# EasyEDA schematic LCEDA_V5.1.json
TITLE: ESP32 Hub75 DevKit; REV: 5.1; Date: 2021-01-13; Sheet: 1/1; Drawn By: Kenn; Company: KZ
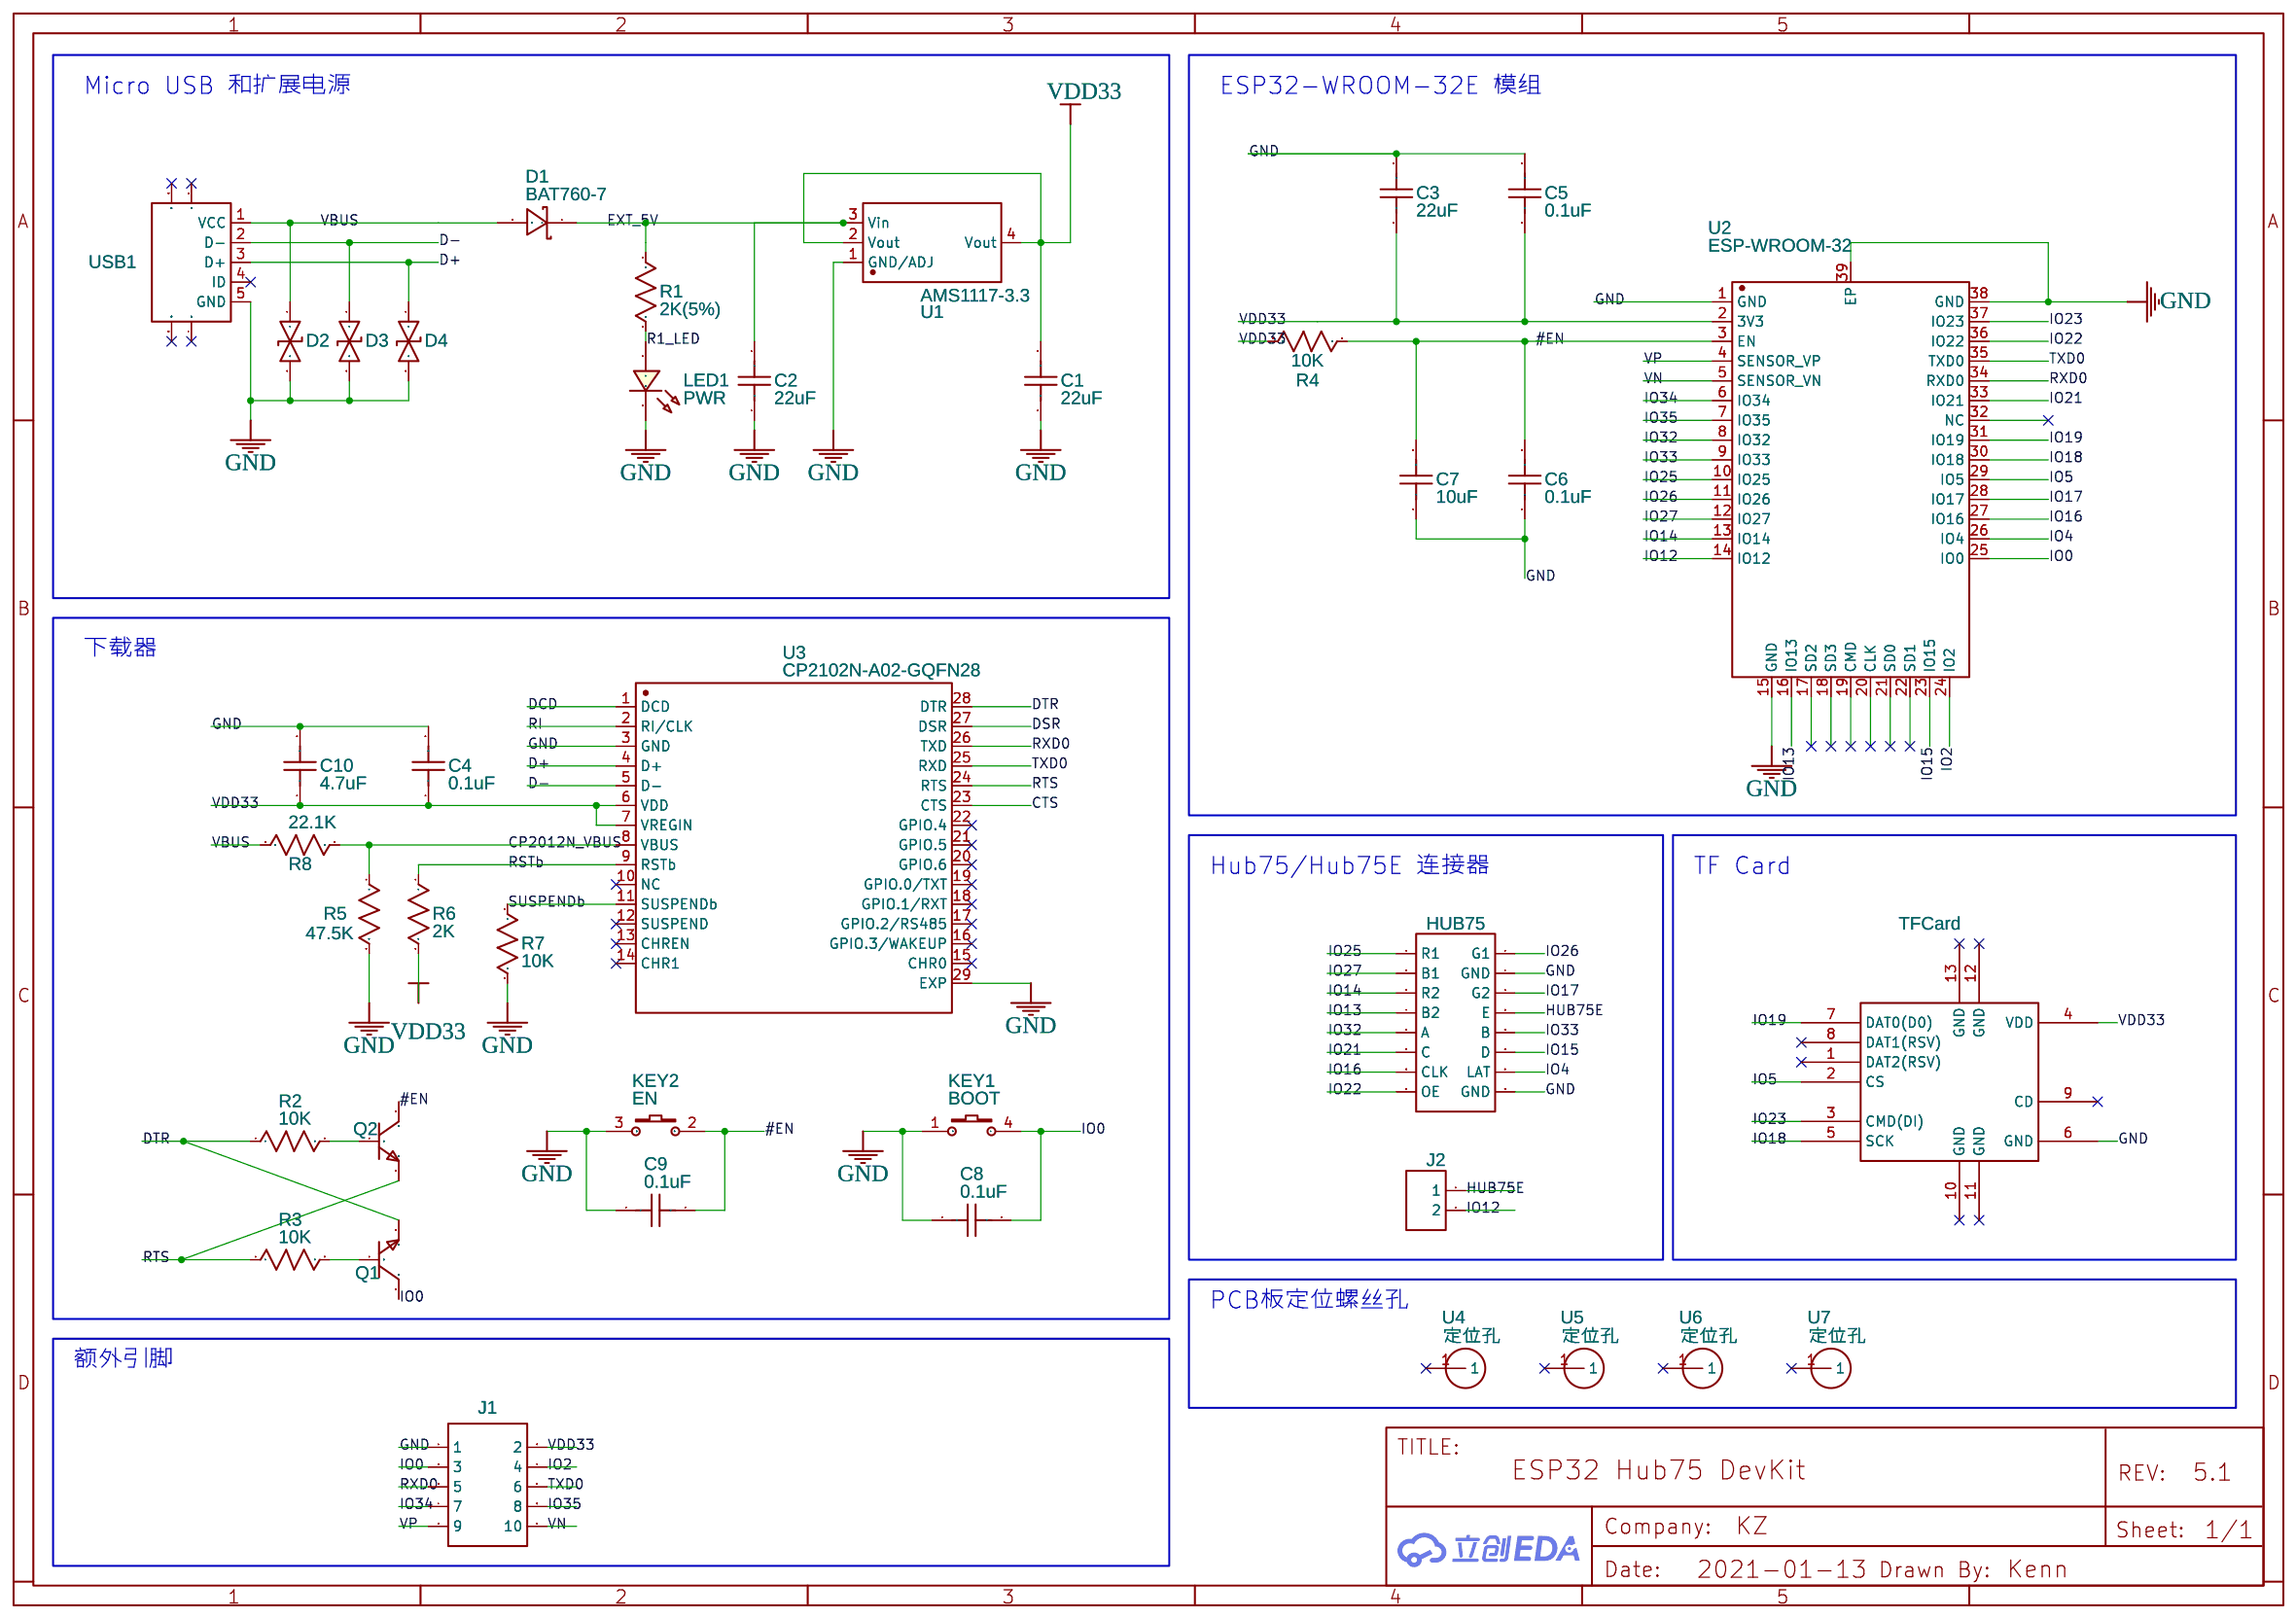
[diagram p0: schematic sheet]

## Parts
C1  22uF  [C0603]
C2  22uF  [C0603]
C3  22uF  [C0603]
C4  0.1uF  [C0603]
C5  0.1uF  [C0603]
C6  0.1uF  [C0603]
C7  10uF  [C0603]
C8  0.1uF  [C0603]
C9  0.1uF  [C0603]
C10  4.7uF  [C0603]
CARD1  TFCard  [TF-SMD_TF-015]
D1  BAT760-7  [SOD-323_L1.8-W1.3-LS2.5-RD]
D2  LESD5D5.0CT1G  [SOD-523_L1.2-W0.8-LS1.6-BI]
D3  LESD5D5.0CT1G  [SOD-523_L1.2-W0.8-LS1.6-BI]
D4  LESD5D5.0CT1G  [SOD-523_L1.2-W0.8-LS1.6-BI]
HUB75  HUB75-IDC-2.54-2X8P  [HDR-IDC-2.54-2X8P]
J1  HDR-M-2.54_2x5  [HDR-M-2.54_2X5]
J2  PIN-E  [HDR-M-2.54_1X2]
KEY1  BOOT  [SW-SMD_4P-L5.1-W5.1-P3.70-LS6.5-TL-2]
KEY2  EN  [SW-SMD_4P-L5.1-W5.1-P3.70-LS6.5-TL-2]
LED1  PWR  [LED0603_RED]
Q1  S8050-G_C164893  [SOT-23-3_L2.9-W1.3-P1.90-LS2.4-BR]
Q2  S8050-G_C164893  [SOT-23-3_L2.9-W1.3-P1.90-LS2.4-BR]
R1  2K(5%)  [R0603]
R2  10K  [R0603]
R3  10K  [R0603]
R4  10K  [R0603]
R5  47.5K  [R0603]
R6  2K  [R0603]
R7  10K  [R0603]
R8  22.1K  [R0603]
U1  AMS1117-3.3  [SOT-223-3_L6.5-W3.4-P2.30-LS7.0-BR]
U2  ESP-WROOM-32  [WIFI-SMD_ESP32-WROOM-32E]
U3  CP2102N-A02-GQFN28  [QFN-28_L5.0-W5.0-P0.50-BL-EP3.3]
U4  定位孔  [M3定位孔]
U5  定位孔  [M3定位孔]
U6  定位孔  [M3定位孔]
U7  定位孔  [M3定位孔]
USB1  USB-Micro_1  [MICRO-USB-SMD_MICROXNJ]

## Library data of the parts
C1-C3 = C_0603_US: Supplier Part: C59461; Supplier: LCSC; Contributor: LCEDA_Lib; Manufacturer Part: CL10A226MQ8NRNC; Manufacturer: SAMSUNG
C4-C6 C8 C9 = C_0603_US: Supplier Part: C14663; Supplier: LCSC; Contributor: LCEDA_Lib; Manufacturer Part: CC0603KRX7R9BB104; Manufacturer: YAGEO
C7 = C_0603_US: Supplier Part: C19702; Supplier: LCSC; Contributor: LCEDA_Lib; Manufacturer Part: CL10A106KP8NNNC; Manufacturer: SAMSUNG 三星
C10 = C_0603_US: Supplier Part: C19666; Supplier: LCSC; Contributor: LCEDA_Lib; Manufacturer Part: CL10A475KO8NNNC; Manufacturer: 三星
CARD1 = TF-015: Supplier: LCSC; Manufacturer: SOFNG; Manufacturer Part: TF-15x15; Supplier Part: C111196
D1 = BAT760-7: Supplier: LCSC; Manufacturer: DIODES; Contributor: LCSC; Supplier Part: C124187; SMT Type: Extend; JLCPCB SMD: Yes
D2-D4 = LESD5D5.0CT1G: Supplier: LCSC; Supplier Part: C383211; Manufacturer: Leshan Radio; Contributor: LCSC; SMT Type: Extend; JLCPCB SMD: Yes
HUB75 = -: Supplier: LCSC; Manufacturer: BOOMELE; Manufacturer Part: IDC Box 2.54mm 16P　Straight; image: //image.lceda.cn/szlcsc/C3406.jpg; Supplier Part: C3406
J1 = HDR-M-2.54_2x5: Supplier Part: C178292; Supplier: LCSC; Contributor: LCEDA_Lib
J2 = HDR-M-2.54_1x2: Supplier Part: C124375; Supplier: LCSC; Contributor: LCEDA_Lib
KEY1 KEY2 = K2-3.6×6.1_SMD: Supplier Part: C318884; Supplier: LCSC; Manufacturer Part: TS-1187A-B-A-B; Contributor: LCEDA_Lib; 制造商: XKB 星坤
LED1 = LED-0603_R: Manufacturer: KENTO; Manufacturer Part: KT-0603R; Supplier Part: C2286; Supplier: LCSC; Contributor: LCEDA_01
Q1 Q2 = S8050-G_C164893: Supplier: LCSC; Supplier Part: C164893; Manufacturer: Changjiang Electronics Tech (CJ); Manufacturer Part: S8050-G; Contributor: 立创EDA官方封装库; LCSC Assembly: Yes; SMT Type: Extend; Package Display: No
R1 R6 = R_0805_US: Supplier Part: C22975; Supplier: LCSC; Contributor: LCEDA_Lib; Manufacturer Part: 0603WAF2001T5E; Package Display: No; Manufacturer: UniOhm
R2 R3 R7 = R_0603_US: Supplier Part: C25804; Supplier: LCSC; Contributor: LCEDA_Lib; Manufacturer Part: 0603WAF1002T5E; Manufacturer: UniOhm
R4 = R_0805_US: Supplier Part: C25804; Supplier: LCSC; Contributor: LCEDA_Lib; Manufacturer Part: 0603WAF1002T5E; Package Display: No; Manufacturer: UniOhm
R5 = R_0603_US: Supplier Part: C23061; Supplier: LCSC; Contributor: LCEDA_Lib; Manufacturer Part: 0603WAF4752T5E; Manufacturer: UNI-ROYAL(厚声)
R8 = R_0603_US: Supplier Part: C25961; Supplier: LCSC; Contributor: LCEDA_Lib; Manufacturer Part: 0603WAF2212T5E; Manufacturer: UNI-ROYAL(厚声)
U1 = AMS1117-3.3: sourceId: dwIGgezVh; Supplier: LCSC; Manufacturer: AMS; image: //image.lceda.cn/szlcsc/C6186.jpg; Supplier Part: C6186; SMT Type: Basic; JLCPCB SMD: Yes
U2 = ESP-WROOM-32: Supplier: LCSC; Manufacturer: ESPRESSIF; Manufacturer Part: ESP32-WROOM-32E(4MB); Supplier Part: C701341
U3 = CP2102N-A01-GQFN28: Supplier: LCSC; Manufacturer: SILICON LABS; Contributor: LCSC; Supplier Part: C1550553; SMT Type: Extend; JLCPCB SMD: Yes
U4-U7 = M2定位孔: Contributor: haxiny
USB1 = USB-Micro_2: Supplier Part: C404969; Supplier: LCSC; Contributor: LCEDA_Lib

## Nets
GND: C1.1 C2.1 C3.2 C4.2 C5.2 C6.1 C7.1 C8.1 C9.1 C10.2 CARD1.6(GND) D2.2 D3.2 D4.2 HUB75.4(GND) HUB75.16(GND) J1.1 KEY1.1 KEY2.3 LED1.2 R5.2 R7.2 U1.1(GND/ADJ) U2.1(GND) U2.15(GND) U2.38(GND) U2.39(EP) U3.3(GND) U3.29(EXP) USB1.5(GND)
VBUS: D1.2 D2.1 R8.2 USB1.1(VCC)
VDD33: C1.2 C3.1 C4.1 C5.1 C10.1 CARD1.4(VDD) J1.2 R4.2 R6.2 U1.2(Vout) U1.4(Vout) U2.2(3V3) U3.6(VDD) U3.7(VREGIN)
#EN: C6.2 C7.2 C9.2 KEY2.2 Q2.3(C) R4.1 U2.3(EN)
CP2012N_VBUS: R5.1 R8.1 U3.8(VBUS)
CTS: U3.23(CTS)
D+: D4.1 U3.4(D+) USB1.3(D+)
D-: D3.1 U3.5(D-) USB1.2(D-)
DCD: U3.1(DCD)
DSR: U3.27(DSR)
DTR: Q1.2(E) R2.1 U3.28(DTR)
EXT_5V: C2.2 D1.1 R1.1 U1.3(Vin)
HUB75E: HUB75.8(E) J2.1
IO0: C8.2 J1.3 KEY1.4 Q1.3(C) U2.25(IO0)
IO2: J1.4 U2.24(IO2)
IO4: HUB75.14(LAT) U2.26(IO4)
IO5: CARD1.2(CS) U2.29(IO5)
IO12: J2.2 U2.14(IO12)
IO13: HUB75.7(B2) U2.16(IO13)
IO14: HUB75.5(R2) U2.13(IO14)
IO15: HUB75.12(D) U2.23(IO15)
IO16: HUB75.13(CLK) U2.27(IO16)
IO17: HUB75.6(G2) U2.28(IO17)
IO18: CARD1.5(SCK) U2.30(IO18)
IO19: CARD1.7(DAT0(D0)) U2.31(IO19)
IO21: HUB75.11(C) U2.33(IO21)
IO22: HUB75.15(OE) U2.36(IO22)
IO23: CARD1.3(CMD(DI)) U2.37(IO23)
IO25: HUB75.1(R1) U2.10(IO25)
IO26: HUB75.2(G1) U2.11(IO26)
IO27: HUB75.3(B1) U2.12(IO27)
IO32: HUB75.9(A) U2.8(IO32)
IO33: HUB75.10(B) U2.9(IO33)
IO34: J1.7 U2.6(IO34)
IO35: J1.8 U2.7(IO35)
R1_LED: LED1.1 R1.2
RI: U3.2(RI/CLK)
RSTb: R6.1 U3.9(RSTb)
RTS: Q2.2(E) R3.1 U3.24(RTS)
RXD0: J1.5 U2.34(RXD0) U3.26(TXD)
SUSPENDb: R7.1 U3.11(SUSPENDb)
TXD0: J1.6 U2.35(TXD0) U3.25(RXD)
VN: J1.10 U2.5(SENSOR_VN)
VP: J1.9 U2.4(SENSOR_VP)
Net-(Q1-1): Q1.1(B) R3.2
Net-(Q2-1): Q2.1(B) R2.2

Not connected (* = marked no-connect by the designer): CARD1 1(DAT2(RSV))* 8(DAT1(RSV))* 9(CD)* 10(GND)* 11(GND)* 12(GND)* 13(GND)*; U2 17(SD2) 18(SD3) 19(CMD) 20(CLK) 21(SD0) 22(SD1) 32(NC); U3 10(NC)* 12(SUSPEND)* 13(CHREN)* 14(CHR1)* 15(CHR0)* 16(GPIO.3/WAKEUP)* 17(GPIO.2/RS485)* 18(GPIO.1/RXT)* 19(GPIO.0/TXT)* 20(GPIO.6)* 21(GPIO.5)* 22(GPIO.4)*; U4 1*; U5 1*; U6 1*; U7 1*; USB1 4(ID)* 6(SH3)* 7(SH4)* 8(SH1)* 9(SH2)*

## Notes on the sheet
- Micro USB 和扩展电源
- ESP32-WROOM-32E 模组
- 下载器
- Hub75/Hub75E 连接器
- TF Card
- PCB板定位螺丝孔
- 额外引脚
